# Altium project Board_Project.PrjPCB
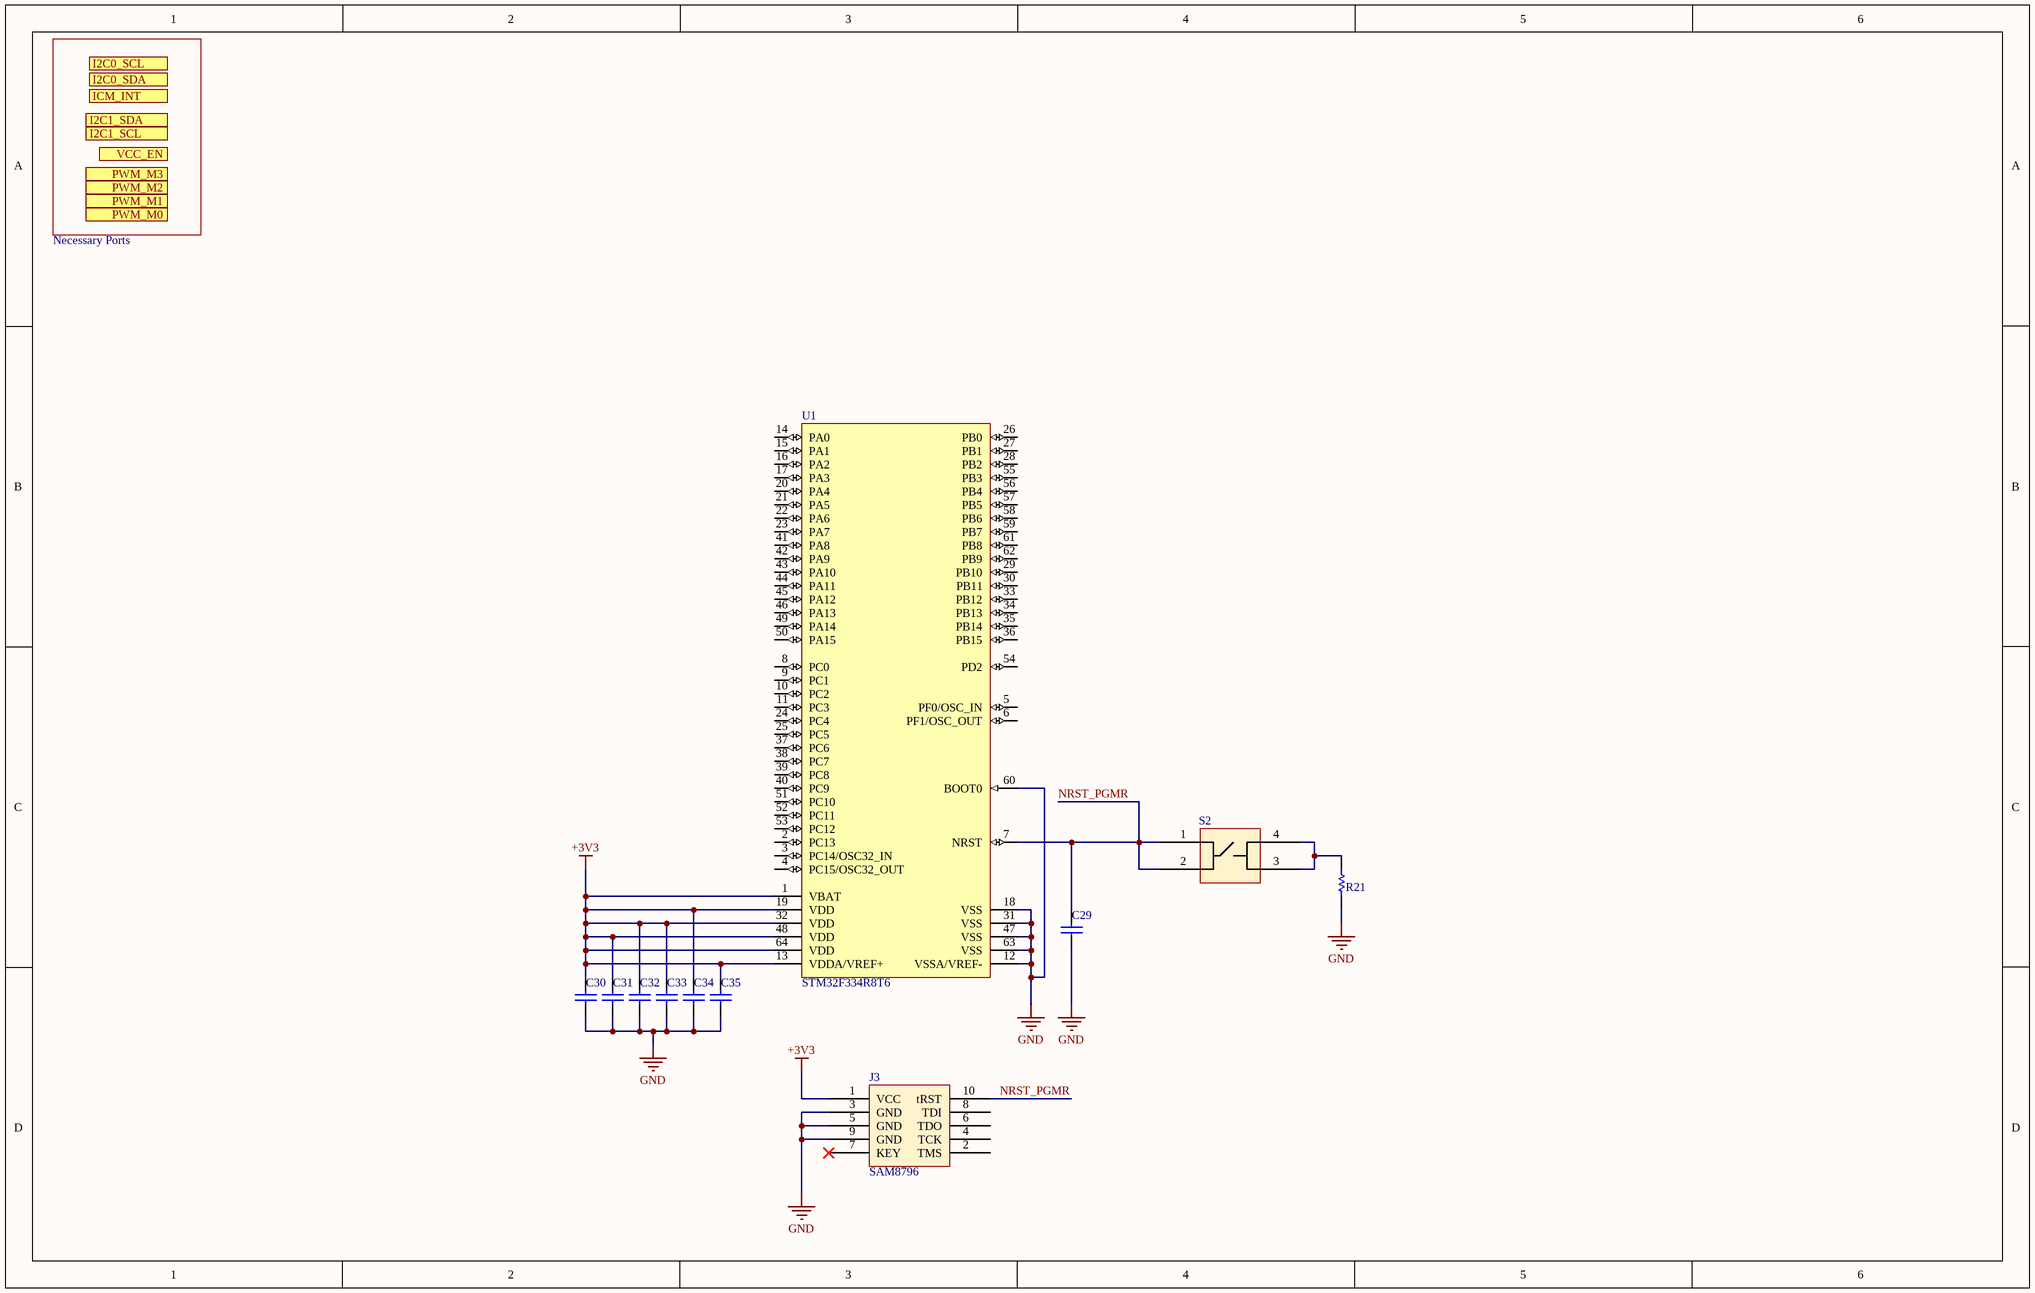
[diagram p0: FC_MC_SCH.SchDoc]
8 sheets, 111 parts. Net scope: flat (ports and power ports of the same name join across sheets).
Board file: Control_Brd.PcbDoc
Sheets:
  FC_MC_SCH.SchDoc
  WiFi_SCH.SchDoc
  IMU_SCH.SchDoc
  LED_SCH.SchDoc
  Signal_Pow_Reg_SCH.SchDoc
  Black_Magic_SCH.SchDoc
  AUX_CPU_SCH.SchDoc
  Bluetooth_SCH.SchDoc

## Sheet FC_MC_SCH.SchDoc
size 381 x 241 mm

### Parts
C29  CAP0402  [CAPC0402(1005)60_L]  (value not drawn)
C30  CAP0402  [CAPC0402(1005)60_L]  (value not drawn)
C31  CAP0402  [CAPC0402(1005)60_L]  (value not drawn)
C32  CAP0402  [CAPC0402(1005)60_L]  (value not drawn)
C33  CAP0402  [CAPC0402(1005)60_L]  (value not drawn)
C34  CAP0402  [CAPC0402(1005)60_L]  (value not drawn)
C35  CAP0402  [CAPC0402(1005)60_L]  (value not drawn)
J3  SAM8796
R21  RES-2  [RES 0402]  (value not drawn)
S2  PTS 647  (value not drawn)
U1  STM32F334R8T6  [STM-LQFP64_L]

### Ports
I2C0_SCL, I2C0_SDA, I2C1_SCL, I2C1_SDA, ICM_INT, PWM_M0 (in), PWM_M1 (in), PWM_M2 (in), PWM_M3 (in), VCC_EN (in)

### Nets
+3V3: C30.2 C31.2 C32.2 C33.2 C34.2 C35.2 J3.1(VCC) U1.1(VBAT) U1.13(VDDA/VREF+) U1.19(VDD) U1.32(VDD) U1.48(VDD) U1.64(VDD)
GND: C29.1 C30.1 C31.1 C32.1 C33.1 C34.1 C35.1 J3.3(GND) J3.5(GND) J3.9(GND) R21.2 U1.12(VSSA/VREF-) U1.18(VSS) U1.31(VSS) U1.47(VSS) U1.60(BOOT0) U1.63(VSS)
NRST_PGMR: C29.2 J3.10(tRST) S2.1 S2.2 U1.7(NRST)
NetR21_1: R21.1 S2.3 S2.4

Not connected (* = marked no-connect by the designer): J3 2(TMS) 4(TCK) 6(TDO) 7(KEY)* 8(TDI); U1 2(PC13) 3(PC14/OSC32_IN) 4(PC15/OSC32_OUT) 5(PF0/OSC_IN) 6(PF1/OSC_OUT) 8(PC0) 9(PC1) 10(PC2) 11(PC3) 14(PA0) 15(PA1) 16(PA2) 17(PA3) 20(PA4) 21(PA5) 22(PA6) 23(PA7) 24(PC4) 25(PC5) 26(PB0) 27(PB1) 28(PB2) 29(PB10) 30(PB11) 33(PB12) 34(PB13) 35(PB14) 36(PB15) 37(PC6) 38(PC7) 39(PC8) 40(PC9) 41(PA8) 42(PA9) 43(PA10) 44(PA11) 45(PA12) 46(PA13) 49(PA14) 50(PA15) 51(PC10) 52(PC11) 53(PC12) 54(PD2) 55(PB3) 56(PB4) 57(PB5) 58(PB6) 59(PB7) 61(PB8) 62(PB9)

### Notes on the sheet
- Necessary Ports

### Library data of the parts
C29 C31 C33-C35 = CMP-1590-00004-1: 0402 (1005 Metric) Chip Capacitor; Case-EIA: 0402; Value: 100n; Case-Metric: 1005; PackageReference: CAPC0402(1005)60
C30 = CMP-1590-00004-1: 0402 (1005 Metric) Chip Capacitor; Case-EIA: 0402; Value: 1u; Case-Metric: 1005; PackageReference: CAPC0402(1005)60
C32 = CMP-1590-00004-1: 0402 (1005 Metric) Chip Capacitor; Case-EIA: 0402; Value: 4.7u; Case-Metric: 1005; PackageReference: CAPC0402(1005)60
R21 = RES: Value: 5k
S2 = TactileSW
U1 = CMP-0537-00077-1: ARM Cortex-M4 32-bit MCU, 64 KB Flash, 16 KB Internal RAM, 51 I/Os, 64-Pin LQFP, -40 to 85 degC, Tray; Supply Voltage(Vcc) min (V): 2; D/A Converter: 3; Internal RAM Size (kB): 16; FLASH Size (Prog) (kB): 64; Operating Frequency(F) (Processor speed) (MHz): 72; I/Os (High Current): 51; ComponentLink1Description: Manufacturer URL; ComponentLink2URL: http://www.st.com/st-web-ui/static/active/en/resource/technical/document/datasheet/DM00097745.pdf; Package Reference: LQFP64; ComponentLink1URL: http://www.st.com/; ComponentLink2Description: Datasheet; DatasheetVersion: Rev. 4; Mounting Technology: Surface Mount; Package Description: 64-Pin Low-profile Quad Flat Package, Body 10 x 10 mm, Pitch 0.5 mm; Packing: Tray; Core: ARM Cortex-M4

## Sheet WiFi_SCH.SchDoc
size A
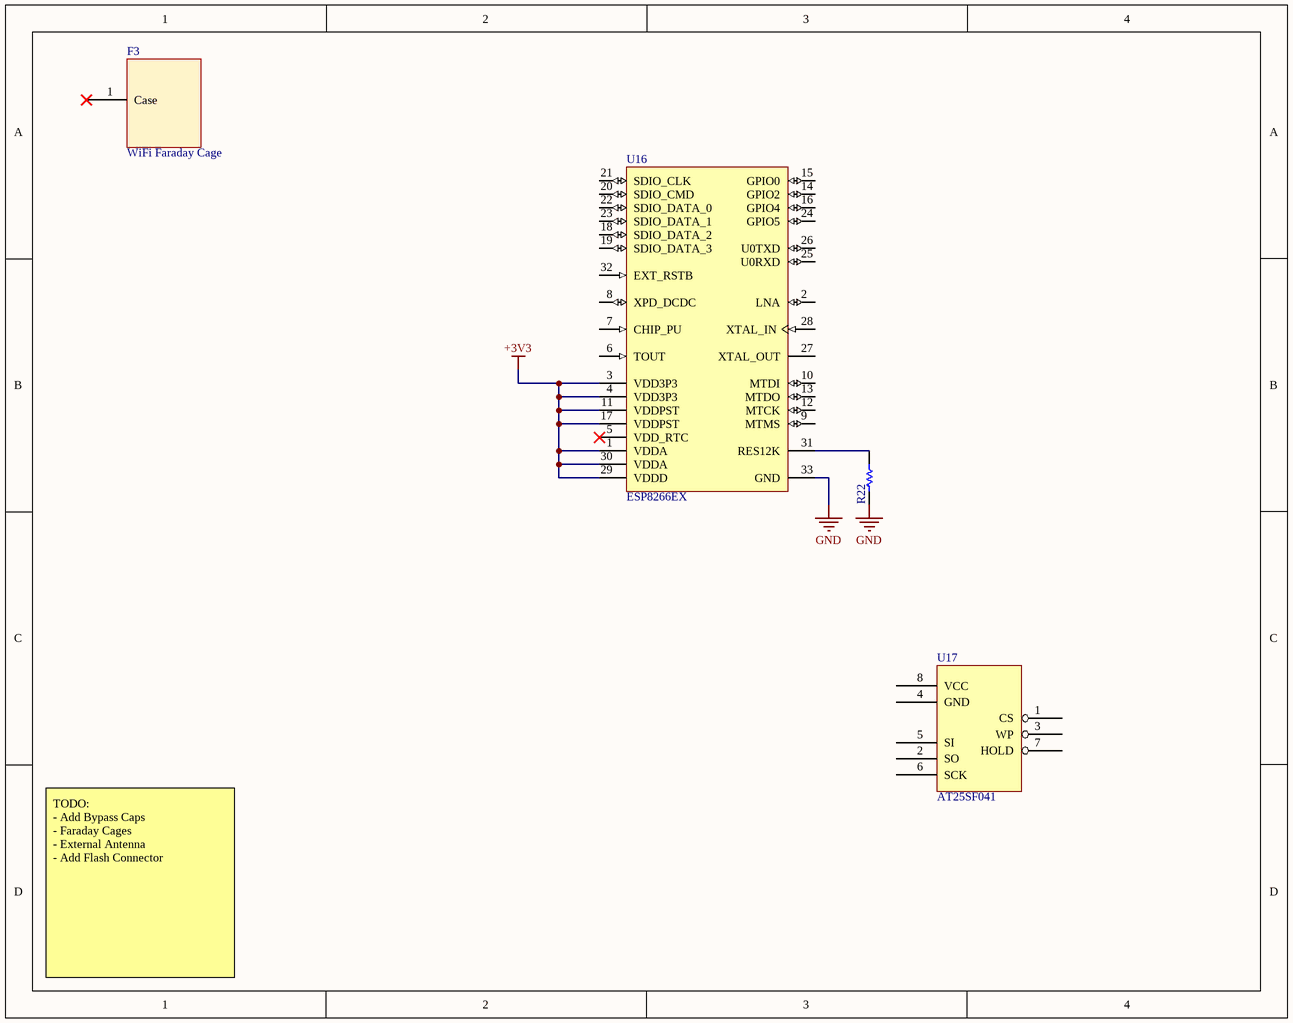
[diagram p1: WiFi_SCH.SchDoc]

### Parts
F3  WiFi Faraday Cage
R22  RES-2  [RES 0402]  (value not drawn)
U16  ESP8266EX  [ESFS-QFN-32_L]
U17  AT25SF041  [SOIC127P600X175-8N]

### Nets
+3V3: U16.1(VDDA) U16.3(VDD3P3) U16.4(VDD3P3) U16.11(VDDPST) U16.17(VDDPST) U16.29(VDDD) U16.30(VDDA)
GND: R22.1 U16.33(GND)
NetR22_2: R22.2 U16.31(RES12K)

Not connected (* = marked no-connect by the designer): F3 1(Case)*; U16 2(LNA) 5(VDD_RTC)* 6(TOUT) 7(CHIP_PU) 8(XPD_DCDC) 9(MTMS) 10(MTDI) 12(MTCK) 13(MTDO) 14(GPIO2) 15(GPIO0) 16(GPIO4) 18(SDIO_DATA_2) 19(SDIO_DATA_3) 20(SDIO_CMD) 21(SDIO_CLK) 22(SDIO_DATA_0) 23(SDIO_DATA_1) 24(GPIO5) 25(U0RXD) 26(U0TXD) 27(XTAL_OUT) 28(XTAL_IN) 32(EXT_RSTB); U17 1(CS) 2(SO) 3(WP) 4(GND) 5(SI) 6(SCK) 7(HOLD) 8(VCC)

### Notes on the sheet
- TODO:
  - Add Bypass Caps
  - Faraday Cages
  - External Antenna
  - Add Flash Connector

### Library data of the parts
F3 = FARADAY_CAGE
R22 = RES: Value: 12k; Tolerance: 1%
U16 = CMP-2000-07453-1: Low-Power, Highly-Integrated Wi-Fi Solution, 2.5 to 3.6 V, 80 mA, -40 to 125 degC, 32-Pin QFN; Manufacturer: Espressif Systems; Mounting Technology: SurfaceMount; Datasheet URL: http://espressif.com/sites/default/files/documentation/0a-esp8266ex_datasheet_en.pdf; Package Reference: QFN-32; Package Description: 32-Pin Quad Falt No-Lead, Body 5 x 5 mm, Pitch 0.5 mm; Manufacturer URL: http://espressif.com; Datasheet Version: Rev. 5.4, 04/2017
U17 = AT25SF041: IC FLASH 4M SPI 104MHZ 8SOIC; ComponentLink1Description: DigiKey; ComponentLink1URL: https://www.digikey.com/product-detail/en/adesto-technologies/AT25SF041-SSHD-T/1265-1131-1-ND/

## Sheet IMU_SCH.SchDoc
size A
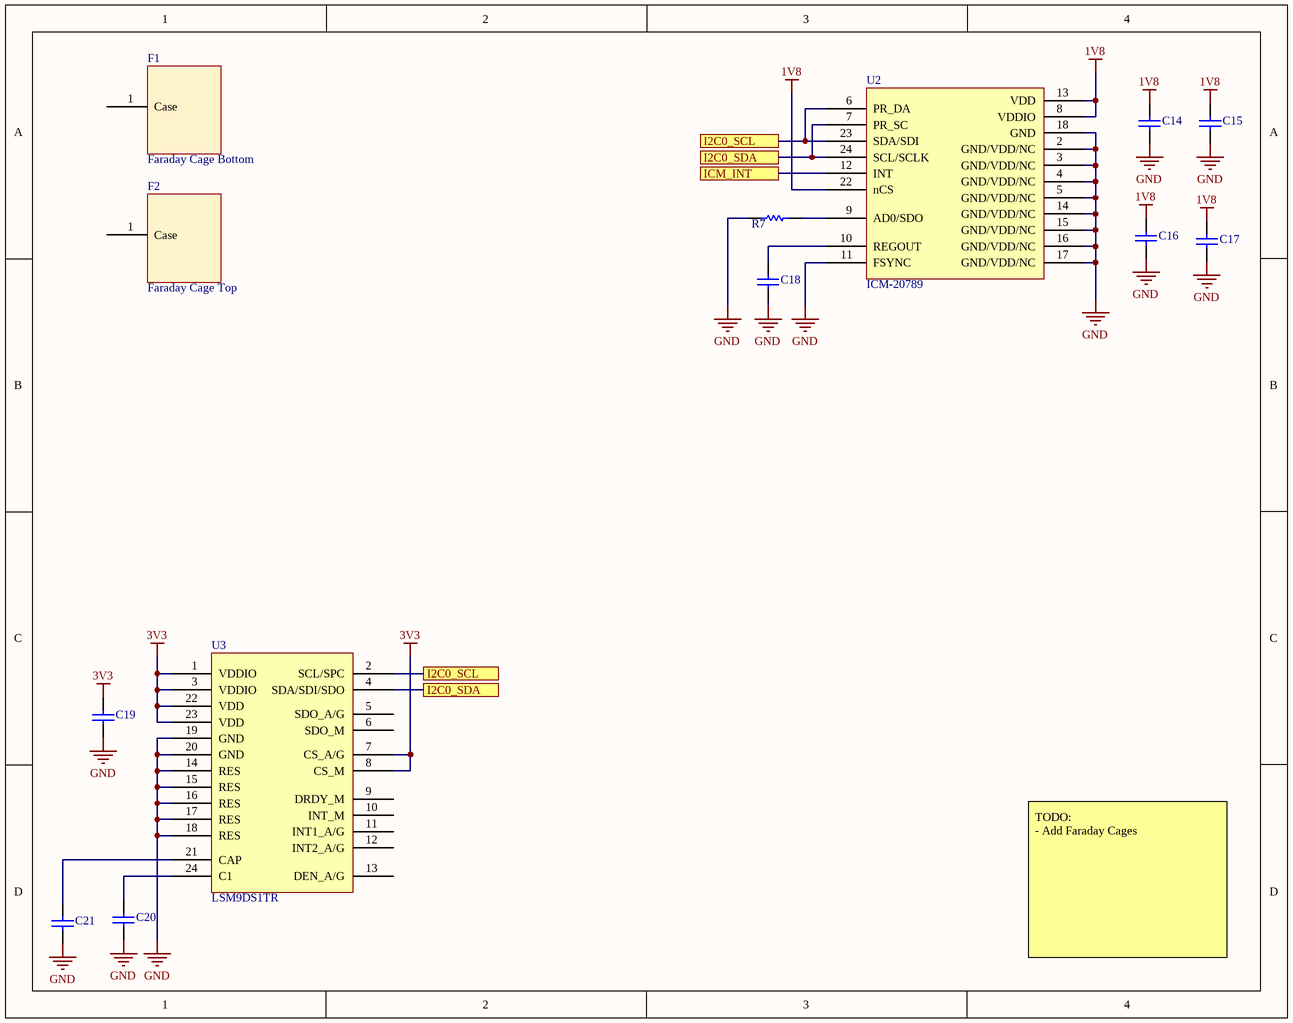
[diagram p2: IMU_SCH.SchDoc]

### Parts
C14  08055C104KAJ2A  [CAPC2013X140X50NL20T25]  (value not drawn)
C15  08055C104KAJ2A  [CAPC2013X140X50NL20T25]  (value not drawn)
C16  08055C104KAJ2A  [CAPC2013X140X50NL20T25]  (value not drawn)
C17  08055C104KAJ2A  [CAPC2013X140X50NL20T25]  (value not drawn)
C18  08055C104KAJ2A  [CAPC2013X140X50NL20T25]  (value not drawn)
C19  08055C104KAJ2A  [CAPC2013X140X50NL20T25]  (value not drawn)
C20  08055C104KAJ2A  [CAPC2013X140X50NL20T25]  (value not drawn)
C21  08055C104KAJ2A  [CAPC2013X140X50NL20T25]  (value not drawn)
F1  Faraday Cage Bottom
F2  Faraday Cage Top
R7  ERJ-6ENF1503V  [RESC2013X70X40LL20T20]  (value not drawn)
U2  ICM-20789  [24LGA]
U3  LSM9DS1TR  [24LGA_Elongated]

### Ports
I2C0_SCL, I2C0_SDA, ICM_INT

### Nets
1V8: C14.2 C15.2 C16.2 C17.2 U2.8(VDDIO) U2.13(VDD) U2.22(nCS)
3V3: C19.2 U3.1(VDDIO) U3.3(VDDIO) U3.7(CS_A/G) U3.8(CS_M) U3.22(VDD) U3.23(VDD)
GND: C14.1 C15.1 C16.1 C17.1 C18.1 C19.1 C20.1 C21.1 R7.1 U2.2(GND/VDD/NC) U2.3(GND/VDD/NC) U2.4(GND/VDD/NC) U2.5(GND/VDD/NC) U2.11(FSYNC) U2.14(GND/VDD/NC) U2.15(GND/VDD/NC) U2.16(GND/VDD/NC) U2.17(GND/VDD/NC) U2.18(GND) U3.14(RES) U3.15(RES) U3.16(RES) U3.17(RES) U3.18(RES) U3.19(GND) U3.20(GND)
NetC18_2: C18.2 U2.10(REGOUT)
NetC20_2: C20.2 U3.24(C1)
NetC21_2: C21.2 U3.21(CAP)
NetR7_2: R7.2 U2.9(AD0/SDO)
NetU2_6: U2.6(PR_DA) U2.23(SDA/SDI) U3.2(SCL/SPC) ; port I2C0_SCL
NetU2_7: U2.7(PR_SC) U2.24(SCL/SCLK) U3.4(SDA/SDI/SDO) ; port I2C0_SDA
NetU2_12: U2.12(INT) ; port ICM_INT

Not connected (* = marked no-connect by the designer): F1 1(Case); F2 1(Case); U3 5(SDO_A/G) 6(SDO_M) 9(DRDY_M) 10(INT_M) 11(INT1_A/G) 12(INT2_A/G) 13(DEN_A/G)

### Notes on the sheet
- TODO:
  - Add Faraday Cages

### Library data of the parts
C14-C21 = CMP-2007-04765-1: Manufacturer: AVX Interconnect / Elco; Part Number: 08055C104KAJ2A
F1 F2 = FARADAY_CAGE
R7 = CMP-2001-04440-2: RES SMD 150K OHM 1% 1/8W 0805; Manufacturer: Panasonic; Datasheet: http://industrial.panasonic.com/cdbs/www-data/pdf/RDA0000/AOA0000C86.pdf; Part Number: ERJ-6ENF1503V
U2 = ICM-20789: MOTION SENSOR IC; ComponentLink1Description: DigiKey; ComponentLink1URL: https://www.digikey.com/product-detail/en/tdk-invensense/ICM-20789/1428-1133-6-ND/
U3 = LSM9DS1TR: IMU ACCEL/GYRO/MAG I2C/SPI 24LGA; ComponentLink1Description: DigiKey; ComponentLink1URL: https://www.digikey.com/product-detail/en/stmicroelectronics/LSM9DS1TR/497-14946-1-ND/

## Sheet LED_SCH.SchDoc
size A
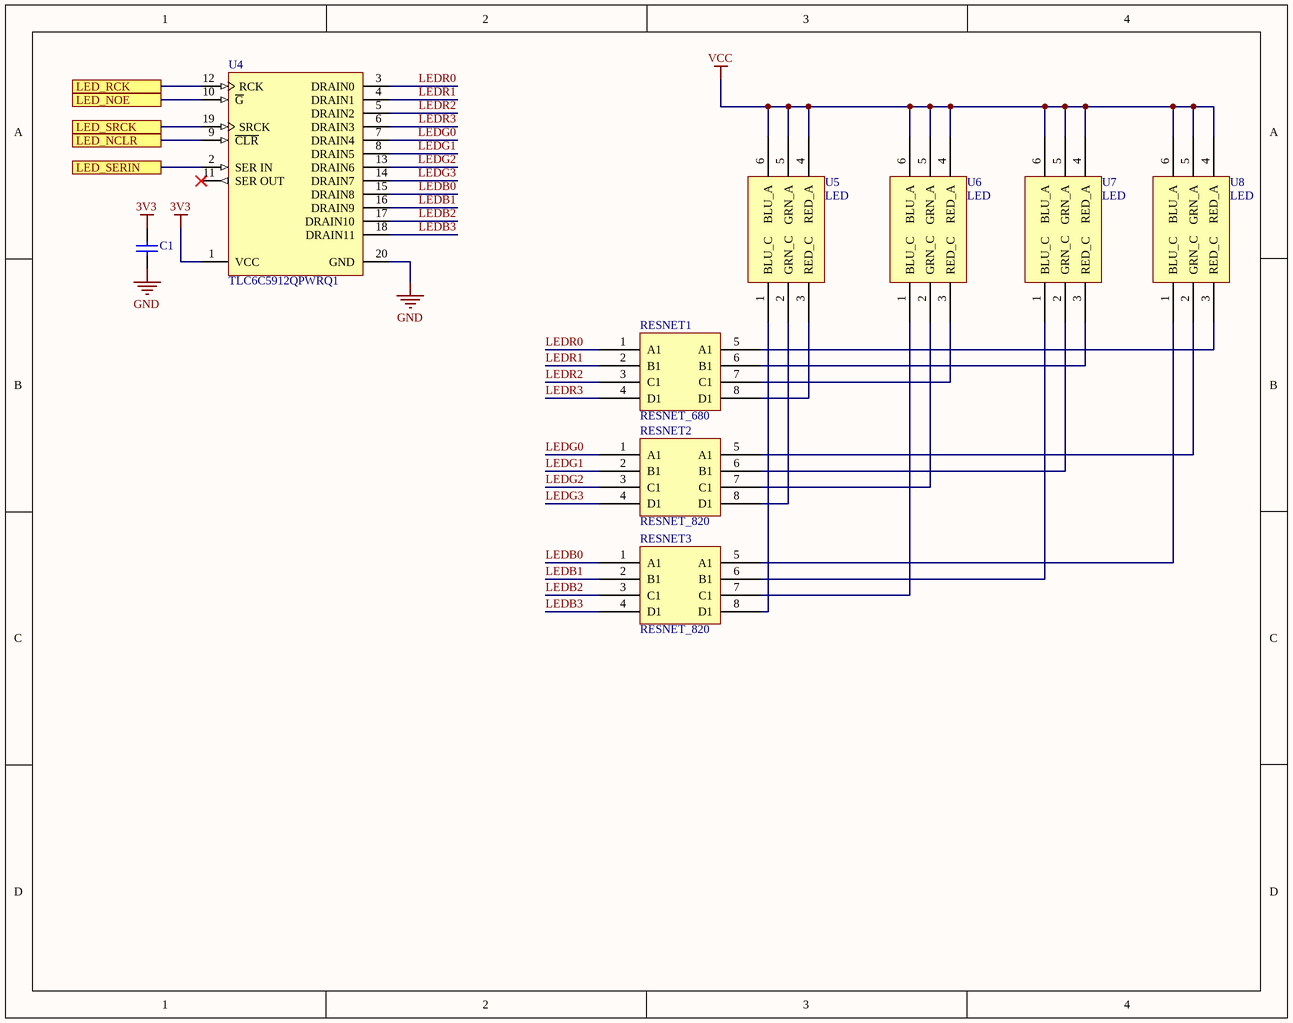
[diagram p3: LED_SCH.SchDoc]

### Parts
C1  08055C104KAJ2A  [CAPC2013X140X50NL20T25]  (value not drawn)
RESNET1  RESNET_680  [CAC-80P320X165-8N]
RESNET2  RESNET_820  [74X_RESNET]
RESNET3  RESNET_820  [74X_RESNET]
U4  TLC6C5912QPWRQ1  [PW0020A_N]
U5  LED  [PLCC6]
U6  LED  [PLCC6]
U7  LED  [PLCC6]
U8  LED  [PLCC6]

### Ports
LED_NCLR, LED_NOE, LED_RCK, LED_SERIN, LED_SRCK

### Nets
3V3: C1.2 U4.1(VCC)
GND: C1.1 U4.20(GND)
VCC: U5.4(RED_A) U5.5(GRN_A) U5.6(BLU_A) U6.4(RED_A) U6.5(GRN_A) U6.6(BLU_A) U7.4(RED_A) U7.5(GRN_A) U7.6(BLU_A) U8.4(RED_A) U8.5(GRN_A) U8.6(BLU_A)
LEDB0: RESNET3.1(A1) U4.15(DRAIN8)
LEDB1: RESNET3.2(B1) U4.16(DRAIN9)
LEDB2: RESNET3.3(C1) U4.17(DRAIN10)
LEDB3: RESNET3.4(D1) U4.18(DRAIN11)
LEDG0: RESNET2.1(A1) U4.7(DRAIN4)
LEDG1: RESNET2.2(B1) U4.8(DRAIN5)
LEDG2: RESNET2.3(C1) U4.13(DRAIN6)
LEDG3: RESNET2.4(D1) U4.14(DRAIN7)
LEDR0: RESNET1.1(A1) U4.3(DRAIN0)
LEDR1: RESNET1.2(B1) U4.4(DRAIN1)
LEDR2: RESNET1.3(C1) U4.5(DRAIN2)
LEDR3: RESNET1.4(D1) U4.6(DRAIN3)
NetRESNET1_5: RESNET1.5(A1) U8.3(RED_C)
NetRESNET1_6: RESNET1.6(B1) U7.3(RED_C)
NetRESNET1_7: RESNET1.7(C1) U6.3(RED_C)
NetRESNET1_8: RESNET1.8(D1) U5.3(RED_C)
NetRESNET2_5: RESNET2.5(A1) U8.2(GRN_C)
NetRESNET2_6: RESNET2.6(B1) U7.2(GRN_C)
NetRESNET2_7: RESNET2.7(C1) U6.2(GRN_C)
NetRESNET2_8: RESNET2.8(D1) U5.2(GRN_C)
NetRESNET3_5: RESNET3.5(A1) U8.1(BLU_C)
NetRESNET3_6: RESNET3.6(B1) U7.1(BLU_C)
NetRESNET3_7: RESNET3.7(C1) U6.1(BLU_C)
NetRESNET3_8: RESNET3.8(D1) U5.1(BLU_C)
NetU4_2: U4.2(SER_IN) ; port LED_SERIN
NetU4_9: U4.9(~{CLR}) ; port LED_NCLR
NetU4_10: U4.10(~{G}) ; port LED_NOE
NetU4_12: U4.12(RCK) ; port LED_RCK
NetU4_19: U4.19(SRCK) ; port LED_SRCK

Not connected (* = marked no-connect by the designer): U4 11(SER_OUT)*

### Library data of the parts
C1 = CMP-2007-04765-1: Manufacturer: AVX Interconnect / Elco; Part Number: 08055C104KAJ2A
RESNET1 = RESNET_680: RES ARRAY 4 RES 680 OHM 2012; ComponentLink1Description: DigiKey; ComponentLink1URL: https://www.digikey.com/product-detail/en/cts-resistor-products/744C083681JP/744C083681JPCT-ND/
RESNET2 RESNET3 = RESNET_820: RES ARRAY 4 RES 820 OHM 2012; ComponentLink1Description: DigiKey; ComponentLink1URL: https://www.digikey.com/product-detail/en/cts-resistor-products/744C083681JP/744C083681JPCT-ND/
U4 = CMP-1582-00026-1: Automotive Power Logic 12-Bit Shift Register LED Driver, PW0020A, LARGE T&R; Part Number: TLC6C5912-Q1; rDS(on)(Ohms): 7.4; tPLH(ns): 210; IO(CONT)(A): 0.05; ICC(uA): 130; VDS(Max)(V): 40; ComponentLink2URL: http://www.ti.com/lit/ds/symlink/tlc6c5912-q1.pdf; ComponentLink1Description: Manufacturer URL; ComponentLink1URL: http://www.ti.com/; Rating: Automotive; Operating Temperature Range(C): -40 to 125; ComponentLink2Description: Datasheet; PackageReference: PW0020A; PartNumber: TLC6C5912QPWRQ1; DatasheetVersion: SLIS141A

## Sheet Signal_Pow_Reg_SCH.SchDoc
size A
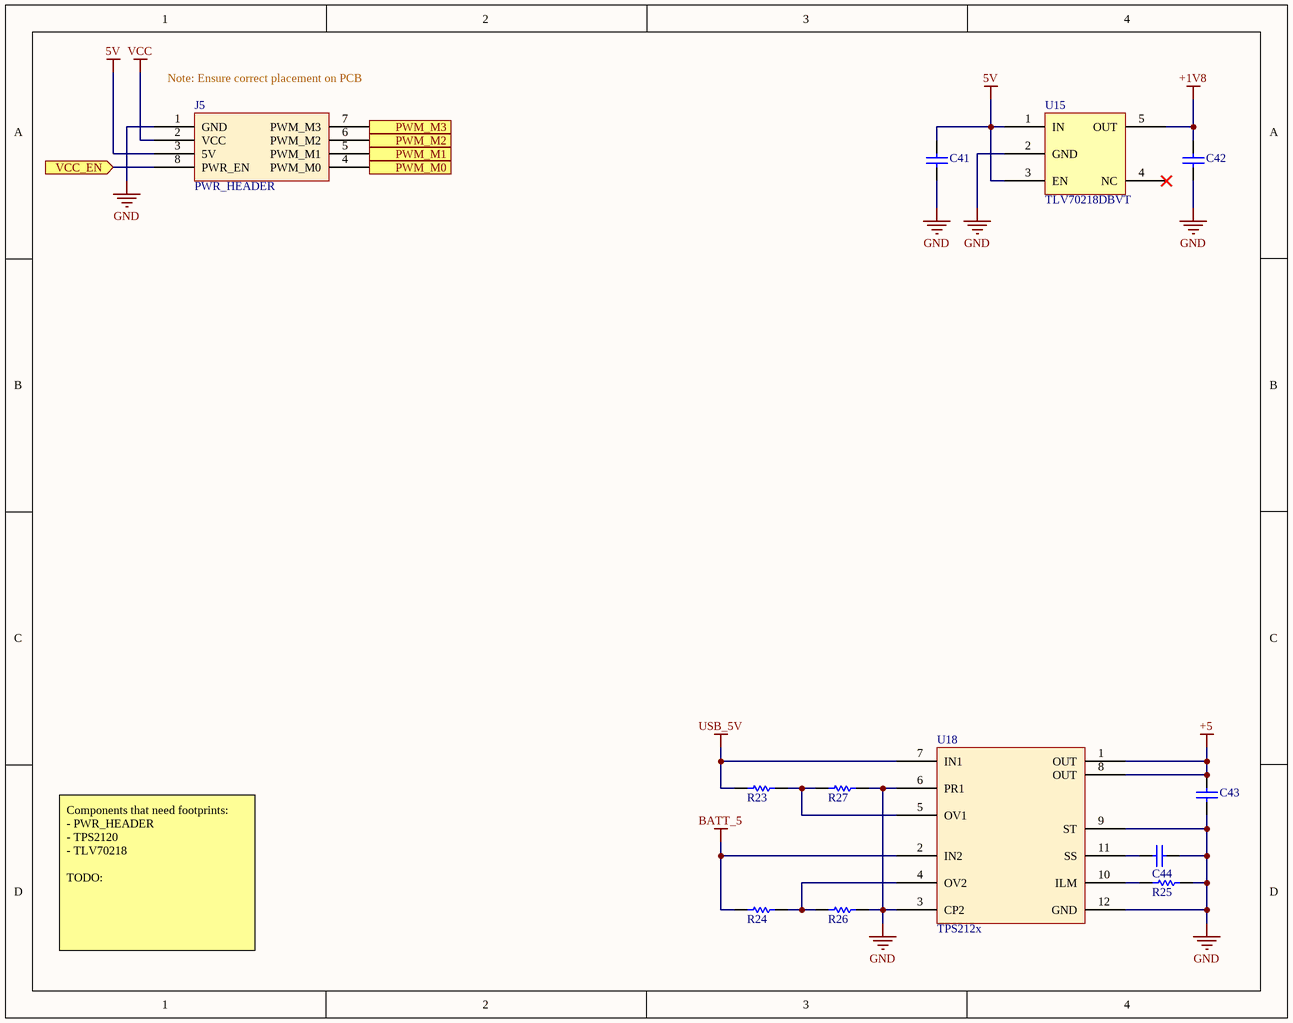
[diagram p4: Signal_Pow_Reg_SCH.SchDoc]

### Parts
C41  08055C104KAJ2A  [CAPC2013X140X50NL20T25]  (value not drawn)
C42  08055C104KAJ2A  [CAPC2013X140X50NL20T25]  (value not drawn)
C43  08055C104KAJ2A  [CAPC2013X140X50NL20T25]  (value not drawn)
C44  08055C104KAJ2A  [CAPC2013X140X50NL20T25]  (value not drawn)
J5  PWR_HEADER
R23  ERJ-6ENF1503V  [RESC2013X70X40LL20T20]  (value not drawn)
R24  ERJ-6ENF1503V  [RESC2013X70X40LL20T20]  (value not drawn)
R25  ERJ-6ENF1503V  [RESC2013X70X40LL20T20]  (value not drawn)
R26  ERJ-6ENF1503V  [RESC2013X70X40LL20T20]  (value not drawn)
R27  ERJ-6ENF1503V  [RESC2013X70X40LL20T20]  (value not drawn)
U15  TLV70218DBVT
U18  TPS212x

### Ports
PWM_M0 (in), PWM_M1 (in), PWM_M2 (in), PWM_M3 (in), VCC_EN (in)

### Nets
5V: C41.2 J5.3(5V) U15.1(IN) U15.3(EN)
+1V8: C42.2 U15.5(OUT)
+5: C43.2 U18.1(OUT) U18.8(OUT)
BATT_5: R24.2 U18.2(IN2)
GND: C41.1 C42.1 C43.1 C44.2 J5.1(GND) R25.2 R26.2 R27.2 U15.2(GND) U18.3(CP2) U18.6(PR1) U18.9(ST) U18.12(GND)
USB_5V: R23.2 U18.7(IN1)
VCC: J5.2(VCC)
NetC44_1: C44.1 U18.11(SS)
NetJ5_4: J5.4(PWM_M0) ; port PWM_M0
NetJ5_5: J5.5(PWM_M1) ; port PWM_M1
NetJ5_6: J5.6(PWM_M2) ; port PWM_M2
NetJ5_7: J5.7(PWM_M3) ; port PWM_M3
NetJ5_8: J5.8(PWR_EN) ; port VCC_EN
NetR23_1: R23.1 R27.1 U18.5(OV1)
NetR24_1: R24.1 R26.1 U18.4(OV2)
NetR25_1: R25.1 U18.10(ILM)

Not connected (* = marked no-connect by the designer): U15 4(NC)*

### Notes on the sheet
- (near J5) Note: Ensure correct placement on PCB
- Components that need footprints:
  - PWR_HEADER
  - TPS2120
  - TLV70218
  TODO:

### Library data of the parts
C41 C42 = CMP-2007-04765-1: Manufacturer: AVX Interconnect / Elco; Value: 1u; Part Number: 08055C104KAJ2A
C43 = CMP-2007-04765-1: Manufacturer: AVX Interconnect / Elco; Value: 100u; Part Number: 08055C104KAJ2A
C44 = CMP-2007-04765-1: Manufacturer: AVX Interconnect / Elco; Value: 0.01u; Part Number: 08055C104KAJ2A
R23 R24 = CMP-2001-04440-2: RES SMD 150K OHM 1% 1/8W 0805; Manufacturer: Panasonic; Value: 23.7k; Datasheet: http://industrial.panasonic.com/cdbs/www-data/pdf/RDA0000/AOA0000C86.pdf; Part Number: ERJ-6ENF1503V
R25 = CMP-2001-04440-2: RES SMD 150K OHM 1% 1/8W 0805; Manufacturer: Panasonic; Value: 51.1k; Datasheet: http://industrial.panasonic.com/cdbs/www-data/pdf/RDA0000/AOA0000C86.pdf; Part Number: ERJ-6ENF1503V
R26 R27 = CMP-2001-04440-2: RES SMD 150K OHM 1% 1/8W 0805; Manufacturer: Panasonic; Value: 5k; Datasheet: http://industrial.panasonic.com/cdbs/www-data/pdf/RDA0000/AOA0000C86.pdf; Part Number: ERJ-6ENF1503V
U15 = TLV702
U18 = TPS212x: PWR MGMT BATTERY MGMT

## Sheet Black_Magic_SCH.SchDoc
size 381 x 241 mm
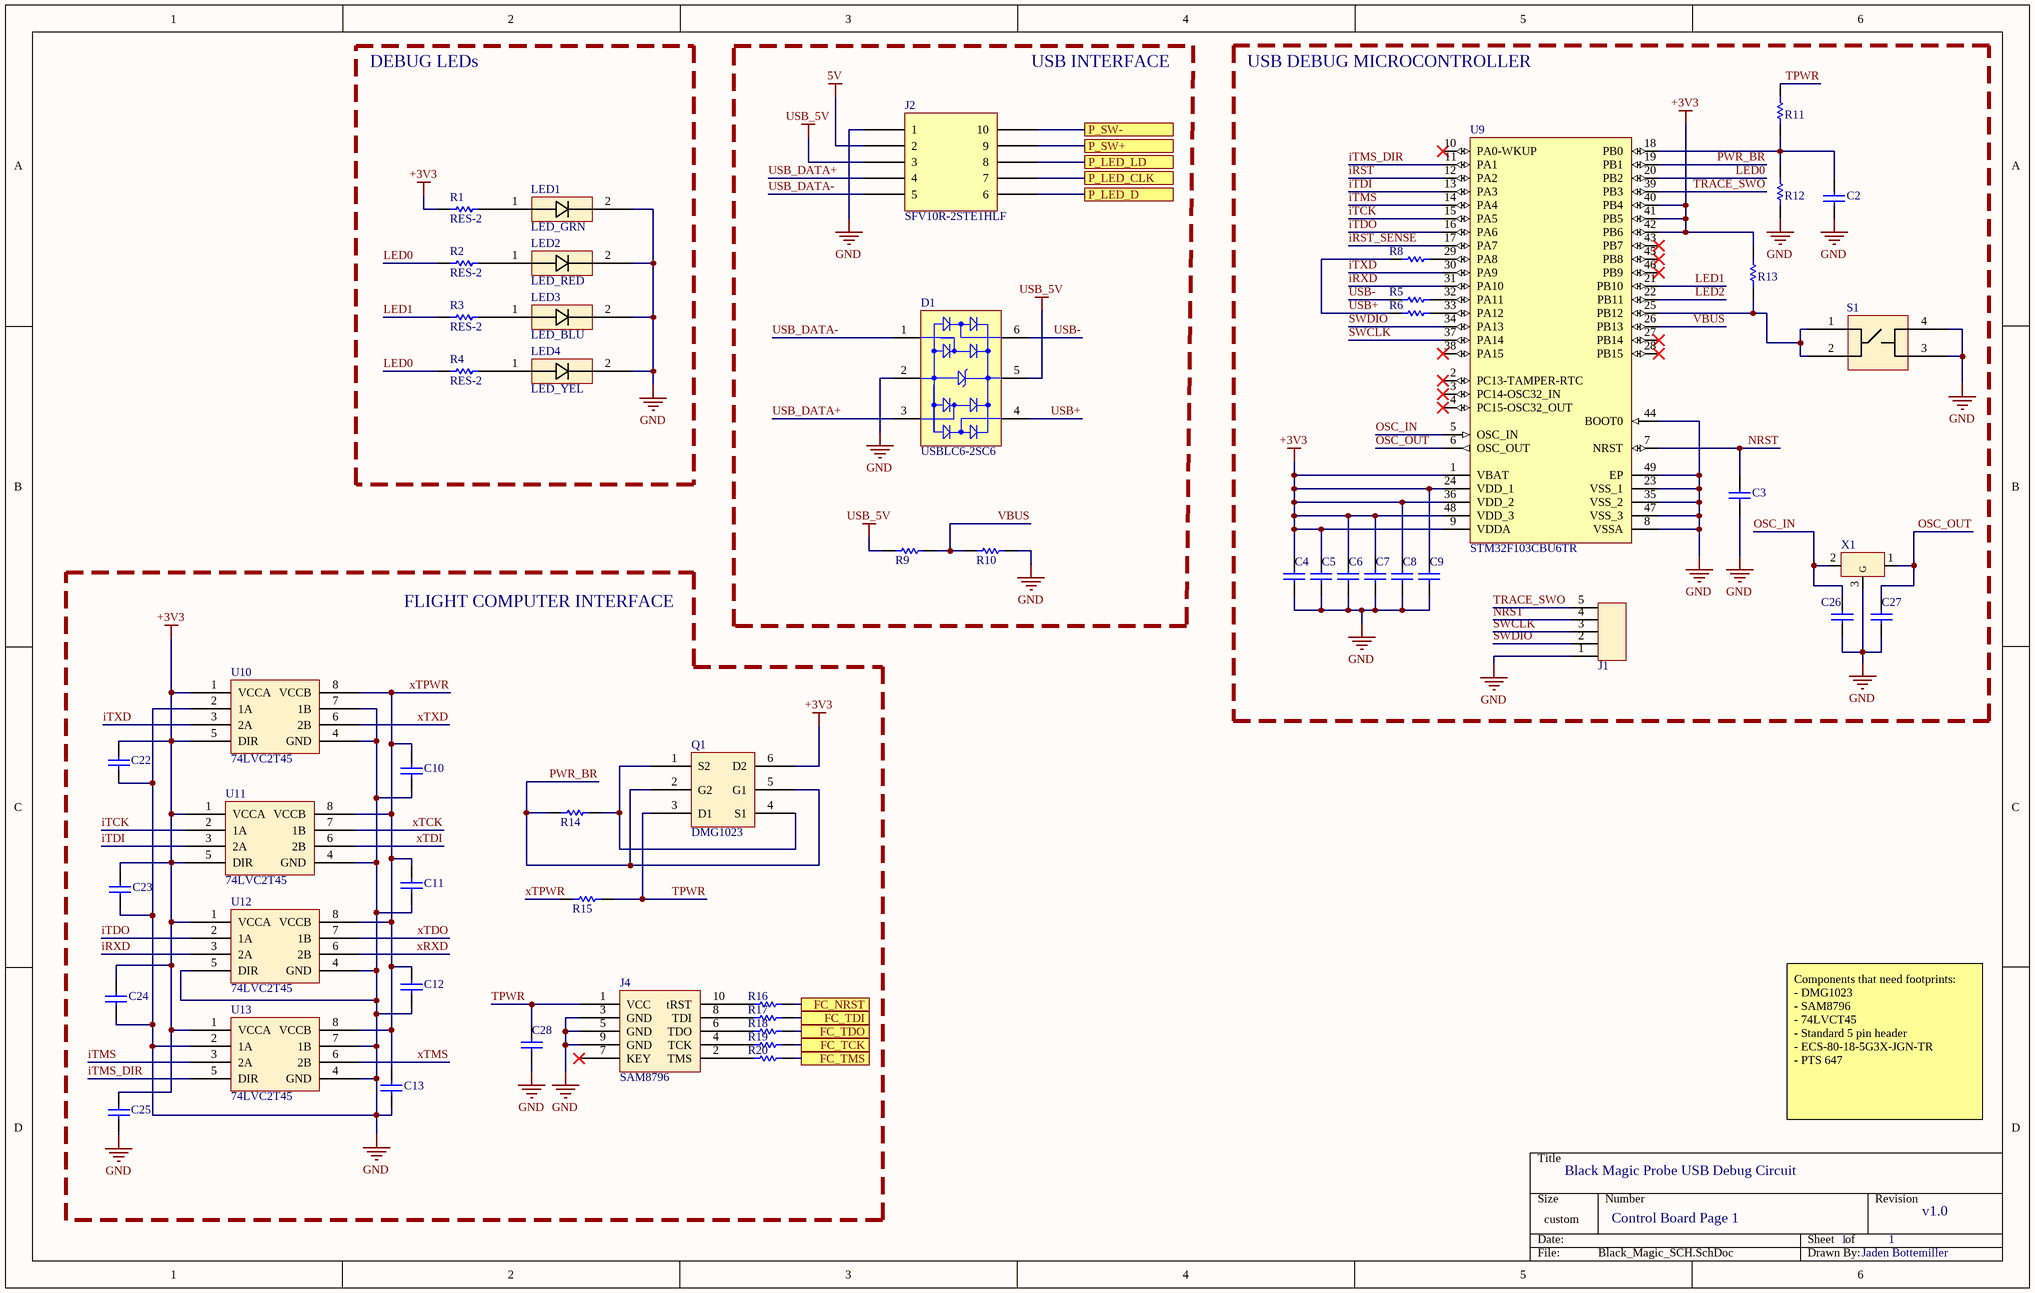
[diagram p5: Black_Magic_SCH.SchDoc]

### Parts
C2  CAP0402  [CAPC0402(1005)60_L]  (value not drawn)
C3  CAP0402  [CAPC0402(1005)60_L]  (value not drawn)
C4  CAP0402  [CAPC0402(1005)60_L]  (value not drawn)
C5  CAP0402  [CAPC0402(1005)60_L]  (value not drawn)
C6  CAP0402  [CAPC0402(1005)60_L]  (value not drawn)
C7  CAP0402  [CAPC0402(1005)60_L]  (value not drawn)
C8  CAP0402  [CAPC0402(1005)60_L]  (value not drawn)
C9  CAP0402  [CAPC0402(1005)60_L]  (value not drawn)
C10  CAP0402  [CAPC0402(1005)60_L]  (value not drawn)
C11  CAP0402  [CAPC0402(1005)60_L]  (value not drawn)
C12  CAP0402  [CAPC0402(1005)60_L]  (value not drawn)
C13  CAP0402  [CAPC0402(1005)60_L]  (value not drawn)
C22  CAP0402  [CAPC0402(1005)60_L]  (value not drawn)
C23  CAP0402  [CAPC0402(1005)60_L]  (value not drawn)
C24  CAP0402  [CAPC0402(1005)60_L]  (value not drawn)
C25  CAP0402  [CAPC0402(1005)60_L]  (value not drawn)
C26  CAP0402  [CAPC0402(1005)60_L]  (value not drawn)
C27  CAP0402  [CAPC0402(1005)60_L]  (value not drawn)
C28  CAP0402  [CAPC0402(1005)60_L]  (value not drawn)
D1  USBLC6-2SC6  [STM-SOT23-6L_V]
J1  5PIN_Standard  (value not drawn)
J2  SFV10R-2STE1HLF
J4  SAM8796
LED1  LED_GRN  [DIOC3212X08N]
LED2  LED_RED  [DIOC3212X08N]
LED3  LED_BLU  [DIOC3212X08N]
LED4  LED_YEL  [DIOC3212X08N]
Q1  DMG1023
R1  RES-2  [RES 0402]
R2  RES-2  [RES 0402]
R3  RES-2  [RES 0402]
R4  RES-2  [RES 0402]
R5  RES-2  [RES 0402]  (value not drawn)
R6  RES-2  [RES 0402]  (value not drawn)
R8  RES-2  [RES 0402]  (value not drawn)
R9  RES-2  [RES 0402]  (value not drawn)
R10  RES-2  [RES 0402]  (value not drawn)
R11  RES-2  [RES 0402]  (value not drawn)
R12  RES-2  [RES 0402]  (value not drawn)
R13  RES-2  [RES 0402]  (value not drawn)
R14  RES-2  [RES 0402]  (value not drawn)
R15  RES-2  [RES 0402]  (value not drawn)
R16  RES-2  [RES 0402]  (value not drawn)
R17  RES-2  [RES 0402]  (value not drawn)
R18  RES-2  [RES 0402]  (value not drawn)
R19  RES-2  [RES 0402]  (value not drawn)
R20  RES-2  [RES 0402]  (value not drawn)
S1  PTS 647  (value not drawn)
U9  STM32F103CBU6TR  [STM-UFQFPN48_L]
U10  74LVC2T45
U11  74LVC2T45
U12  74LVC2T45
U13  74LVC2T45
X1  ECS-80-18-5G3X-JGN-TR  (value not drawn)

### Blocks framed on the sheet
DEBUG LEDs: LED1-LED4 R1-R4
USB INTERFACE: D1 J2 R9 R10
USB DEBUG MICROCONTROLLER: C2-C9 C26 C27 J1 R5 R6 R8 R11-R13 S1 U9 X1
FLIGHT COMPUTER INTERFACE: C10-C13 C22-C25 C28 J4 Q1 R14-R20 U10-U13

### Ports
FC_NRST, FC_TCK, FC_TDI, FC_TDO, FC_TMS, P_LED_CLK, P_LED_D, P_LED_LD, P_SW+, P_SW-

### Nets
5V: J2.2
+3V3: C4.2 C5.2 C6.2 C7.2 C8.2 C9.2 C22.2 C23.2 C24.2 C25.2 Q1.6(D2) R1.1 R13.1 U9.1(VBAT) U9.9(VDDA) U9.24(VDD_1) U9.36(VDD_2) U9.40(PB4) U9.41(PB5) U9.42(PB6) U9.48(VDD_3) U10.1(VCCA) U10.5(DIR) U11.1(VCCA) U11.5(DIR) U12.1(VCCA) U13.1(VCCA)
GND: C2.1 C3.1 C4.1 C5.1 C6.1 C7.1 C8.1 C9.1 C10.1 C11.1 C12.1 C13.1 C22.1 C23.1 C24.1 C25.1 C26.1 C27.1 C28.1 D1.2(GND) J1.1(A) J2.1 J4.3(GND) J4.5(GND) J4.9(GND) LED1.2(Cathode) LED2.2(Cathode) LED3.2(Cathode) LED4.2(Cathode) R10.2 R12.2 S1.3 S1.4 U9.8(VSSA) U9.23(VSS_1) U9.35(VSS_2) U9.44(BOOT0) U9.47(VSS_3) U9.49(EP) U10.2(1A) U10.4(GND) U10.7(1B) U11.4(GND) U12.4(GND) U12.5(DIR) U13.2(1A) U13.4(GND) U13.7(1B) X1.3(G)
USB_5V: D1.5(VBUS) J2.3 R9.2
iRST: U9.12(PA2)
iRST_SENSE: U9.17(PA7)
iRXD: U9.31(PA10) U12.3(2A)
iTCK: U9.15(PA5) U11.2(1A)
iTDI: U9.13(PA3) U11.3(2A)
iTDO: U9.16(PA6) U12.2(1A)
iTMS: U9.14(PA4) U13.3(2A)
iTMS_DIR: U9.11(PA1) U13.5(DIR)
iTXD: U9.30(PA9) U10.3(2A)
LED0: R2.1 R4.1 U9.20(PB2)
LED1: R3.1 U9.21(PB10)
LED2: U9.22(PB11)
NRST: C3.2 J1.4(A) U9.7(NRST)
OSC_IN: C26.2 U9.5(OSC_IN) X1.2(IN/OUT)
OSC_OUT: C27.2 U9.6(OSC_OUT) X1.1(IN/OUT)
PWR_BR: Q1.2(G2) Q1.5(G1) R14.2 U9.19(PB1)
SWCLK: J1.3(A) U9.37(PA14)
SWDIO: J1.2(A) U9.34(PA13)
TPWR: C28.2 J4.1(VCC) Q1.3(D1) R11.1 R15.1
TRACE_SWO: J1.5(A) U9.39(PB3)
USB+: D1.4(I/O_3) R6.1 R8.1
USB-: D1.6(I/O_4) R5.1
USB_DATA+: D1.3(I/O_2) J2.4
USB_DATA-: D1.1(I/O_1) J2.5
VBUS: R9.1 R10.1 U9.26(PB13)
xRXD: U12.6(2B)
xTCK: U11.7(1B)
xTDI: U11.6(2B)
xTDO: U12.7(1B)
xTMS: U13.6(2B)
xTPWR: C10.2 C11.2 C12.2 C13.2 R15.2 U10.8(VCCB) U11.8(VCCB) U12.8(VCCB) U13.8(VCCB)
xTXD: U10.6(2B)
NetC2_2: C2.2 R11.2 R12.1 U9.18(PB0)
NetJ2_6: J2.6 ; port P_LED_D
NetJ2_7: J2.7 ; port P_LED_CLK
NetJ2_8: J2.8 ; port P_LED_LD
NetJ2_9: J2.9 ; port P_SW+
NetJ2_10: J2.10 ; port P_SW-
NetJ4_2: J4.2(TMS) R20.2
NetJ4_4: J4.4(TCK) R19.2
NetJ4_6: J4.6(TDO) R18.2
NetJ4_8: J4.8(TDI) R17.2
NetJ4_10: J4.10(tRST) R16.2
NetLED1_1: LED1.1(Anode) R1.2
NetLED2_1: LED2.1(Anode) R2.2
NetLED3_1: LED3.1(Anode) R3.2
NetLED4_1: LED4.1(Anode) R4.2
NetQ1_1: Q1.1(S2) Q1.4(S1) R14.1
NetR5_2: R5.2 U9.32(PA11)
NetR6_2: R6.2 U9.33(PA12)
NetR8_2: R8.2 U9.29(PA8)
NetR13_2: R13.2 S1.1 S1.2 U9.25(PB12)
NetR16_1: R16.1 ; port FC_NRST
NetR17_1: R17.1 ; port FC_TDI
NetR18_1: R18.1 ; port FC_TDO
NetR19_1: R19.1 ; port FC_TCK
NetR20_1: R20.1 ; port FC_TMS

Not connected (* = marked no-connect by the designer): J4 7(KEY)*; U9 2(PC13-TAMPER-RTC)* 3(PC14-OSC32_IN)* 4(PC15-OSC32_OUT)* 10(PA0-WKUP)* 27(PB14)* 28(PB15)* 38(PA15)* 43(PB7)* 45(PB8)* 46(PB9)*

### Notes on the sheet
- Black Magic Probe USB Debug Circuit
- Components that need footprints:
  - DMG1023
  - SAM8796
  - 74LVCT45
  - Standard 5 pin header
  - ECS-80-18-5G3X-JGN-TR
  - PTS 647
- Control Board Page 1
- 1
- v1.0
- Jaden Bottemiller

### Library data of the parts
C2 C3 C5 C7-C13 C22-C25 C28 = CMP-1590-00004-1: as C29 on sheet FC_MC_SCH; PackageReference: CAPC0402(1005)60
C4 = CMP-1590-00004-1: as C30 on sheet FC_MC_SCH; PackageReference: CAPC0402(1005)60
C6 = CMP-1590-00004-1: as C32 on sheet FC_MC_SCH; PackageReference: CAPC0402(1005)60
C26 C27 = CMP-1590-00004-1: 0402 (1005 Metric) Chip Capacitor; Case-EIA: 0402; Value: 18pF; Case-Metric: 1005; PackageReference: CAPC0402(1005)60
D1 = CMP-2000-05378-1: Very low capacitance ESD protection, 3.5 pF, -40 to 125 degC, 6-Pin SOT23, RoHS, Tape and Reel; Manufacturer: STMicroelectronics; Polarity: Uni-Directional; Clamping Voltage: 17V; Rad Hardened: No; Product Height (mm): 1.3mm; Leakage Current (Max): 0.15uA; Product Length (mm): 3.05mm; Number of Elements: 1; Peak Pulse Current: 5A; Configuration: Dual; Reverse Breakdown Voltage: 6V; Working Voltage (Max): 5V; Capacitance Value: 3.5pF; Suppressor Type: DiodeArrays; Product Depth (mm): 1.75mm; Test Current (It): 1mA; Package / Case: SOT-23; Operating Temperature Max Deg. C: 125C; Package Description: 6-Pin Small Outline Transistor, Body 2.925 x 1.625 mm, Pitch 0.95 mm; Package Reference: SOT23-6L; Datasheet Version: Rev. 5, 10/2011; Operating Temperature Min Deg. C: -40C; Mounting Style: SurfaceMount; Direction Type: Uni-Directional; Mounting: SurfaceMount; Pin Count: 6; Leakage Current: 0.15uA; Packaging: TapeandReel; Operating Temperature Classification: Automotive; Clamping Voltage (Max): 17V; Manufacturer URL: http://www.st.com/; Reverse Stand-off Voltage: 5V; Datasheet URL: http://www.st.com/st-web-ui/static/active/en/resource/technical/document/datasheet/CD00050750.pdf; Working Voltage: 5V; Operating Temp Range: -40Cto125C
J2 = SFV10R-2STE1HLF: System: Connector
LED2-LED4 = LED_GRN
R1-R4 = RES: Value: 330
R5 R6 = RES: Value: 22
R8 = RES: Value: 1.5k
R9 R11 = RES: Value: 4.7k
R10 R12 R13 = RES: Value: 10k
R14-R20 = RES: Value: 100
S1 = TactileSW
U9 = CMP-0237-00304-1: ARM Cortex-M3 32-bit MCU, 128 KB Flash, 20 KB Internal RAM, 37 I/Os, 48-Pin UFQFPN, -40 to 85 degC, Tape and Reel; I/Os (High Current): 36; Internal RAM Size (kB): 20; Operating Frequency(F) (Processor speed) (MHz): 72; Supply Voltage(Vcc) min (V): 2; FLASH Size (Prog) (kB): 128; Packing: Tape and Reel; ComponentLink2URL: http://www.st.com/st-web-ui/static/active/en/resource/technical/document/datasheet/CD00161566.pdf; ComponentLink1Description: Manufacturer URL; Package Reference: UFQFPN48; Mounting Technology: Surface Mount; Core: ARM Cortex-M3; ComponentLink2Description: Datasheet; Package Description: 48-Pin Ultra Thin Fine Pitch Quad Flat No-Lead, 7 x 7 x 0.6 mm Body, 0.5 mm Pitch, Exposed Pad; DatasheetVersion: Rev. 17; ComponentLink1URL: http://www.st.com/

## Sheet AUX_CPU_SCH.SchDoc
size A
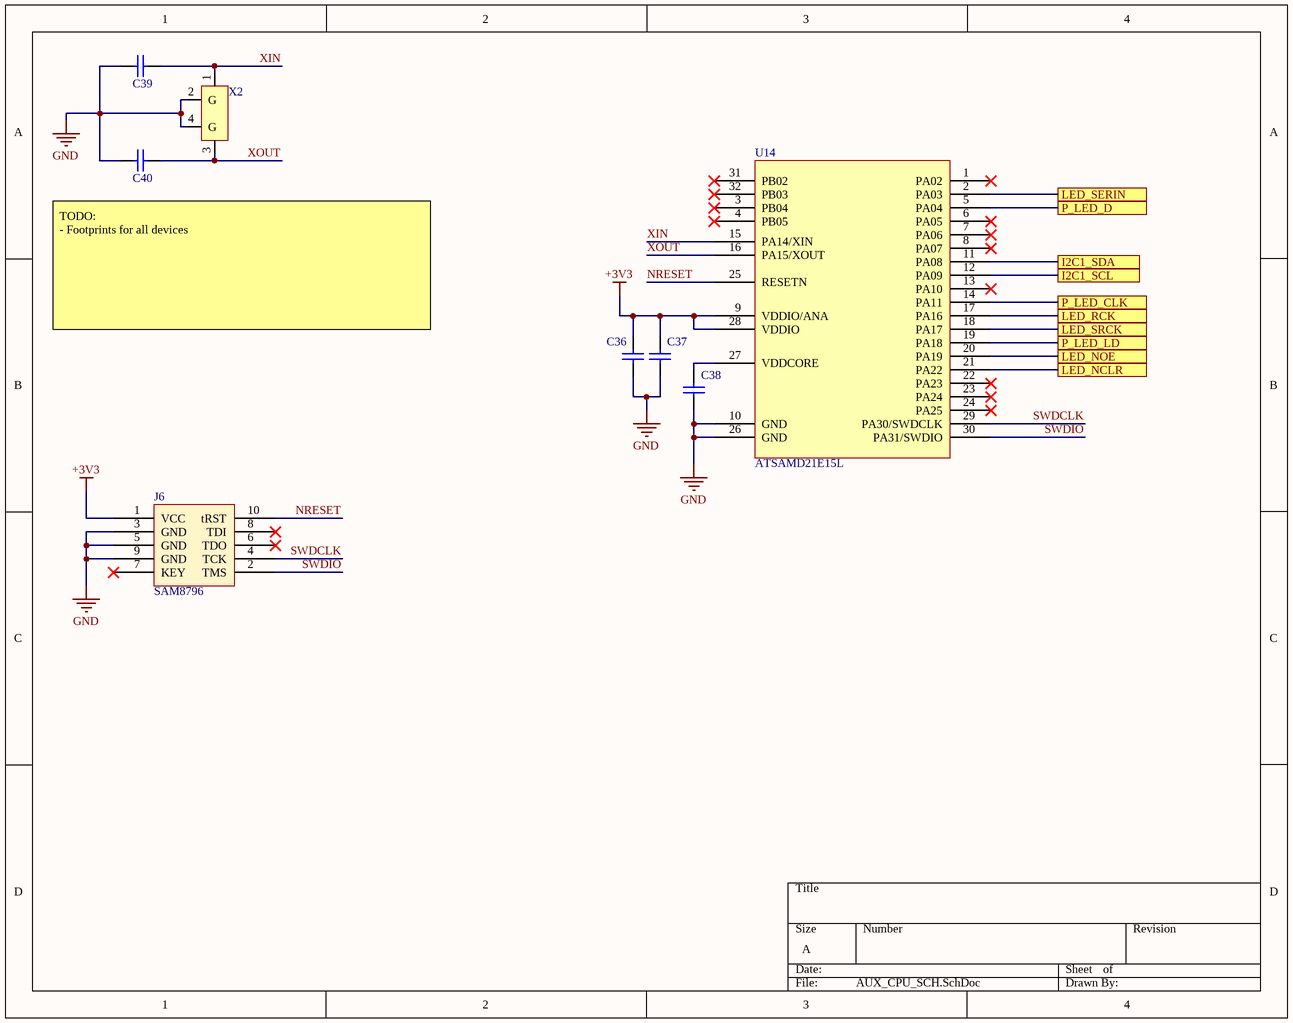
[diagram p6: AUX_CPU_SCH.SchDoc]

### Parts
C36  CAP0402  [CAPC0402(1005)60_L]  (value not drawn)
C37  CAP0402  [CAPC0402(1005)60_L]  (value not drawn)
C38  CAP0402  [CAPC0402(1005)60_L]  (value not drawn)
C39  CAP0402  [CAPC0402(1005)60_L]  (value not drawn)
C40  CAP0402  [CAPC0402(1005)60_L]  (value not drawn)
J6  SAM8796
U14  ATSAMD21E15L
X2  ECS-480-18-30B-AGN-TR  (value not drawn)

### Ports
I2C1_SCL, I2C1_SDA, LED_NCLR, LED_NOE, LED_RCK, LED_SERIN, LED_SRCK, P_LED_CLK, P_LED_D, P_LED_LD

### Nets
+3V3: C36.2 C37.2 J6.1(VCC) U14.9(VDDIO/ANA) U14.28(VDDIO)
GND: C36.1 C37.1 C38.1 C39.2 C40.2 J6.3(GND) J6.5(GND) J6.9(GND) U14.10(GND) U14.26(GND) X2.2(G) X2.4(G)
NRESET: J6.10(tRST) U14.25(RESETN)
SWDCLK: J6.4(TCK) U14.29(PA30/SWDCLK)
SWDIO: J6.2(TMS) U14.30(PA31/SWDIO)
XIN: C39.1 U14.15(PA14/XIN) X2.1(XIN)
XOUT: C40.1 U14.16(PA15/XOUT) X2.3(XOUT)
NetC38_2: C38.2 U14.27(VDDCORE)
NetJ2_6: U14.5(PA04) ; port P_LED_D
NetJ2_7: U14.14(PA11) ; port P_LED_CLK
NetJ2_8: U14.19(PA18) ; port P_LED_LD
NetU4_2: U14.2(PA03) ; port LED_SERIN
NetU4_9: U14.21(PA22) ; port LED_NCLR
NetU4_10: U14.20(PA19) ; port LED_NOE
NetU4_12: U14.17(PA16) ; port LED_RCK
NetU4_19: U14.18(PA17) ; port LED_SRCK
NetU14_11: U14.11(PA08) ; port I2C1_SDA
NetU14_12: U14.12(PA09) ; port I2C1_SCL

Not connected (* = marked no-connect by the designer): J6 6(TDO)* 7(KEY)* 8(TDI)*; U14 1(PA02)* 3(PB04)* 4(PB05)* 6(PA05)* 7(PA06)* 8(PA07)* 13(PA10)* 22(PA23)* 23(PA24)* 24(PA25)* 31(PB02)* 32(PB03)*

### Notes on the sheet
- TODO:
  - Footprints for all devices

### Library data of the parts
C36 C38 = CMP-1590-00004-1: as C30 on sheet FC_MC_SCH; PackageReference: CAPC0402(1005)60
C37 = CMP-1590-00004-1: as C29 on sheet FC_MC_SCH; PackageReference: CAPC0402(1005)60
C39 C40 = CMP-1590-00004-1: as C26 on sheet Black_Magic_SCH; PackageReference: CAPC0402(1005)60

## Sheet Bluetooth_SCH.SchDoc
size A

## Nets that join several sheets
3V3: IMU_SCH (7 pins), LED_SCH (C1.2 U4.1)
5V: Signal_Pow_Reg_SCH (C41.2 J5.3 U15.1 U15.3), Black_Magic_SCH (J2.2)
+3V3: FC_MC_SCH (13 pins), WiFi_SCH (7 pins), Black_Magic_SCH (27 pins), AUX_CPU_SCH (5 pins)
GND: FC_MC_SCH (17 pins), WiFi_SCH (R22.1 U16.33), IMU_SCH (26 pins), LED_SCH (C1.1 U4.20), Signal_Pow_Reg_SCH (13 pins), Black_Magic_SCH (49 pins), AUX_CPU_SCH (12 pins)
USB_5V: Signal_Pow_Reg_SCH (R23.2 U18.7), Black_Magic_SCH (D1.5 J2.3 R9.2)
VCC: LED_SCH (12 pins), Signal_Pow_Reg_SCH (J5.2)
NetJ2_6: Black_Magic_SCH (J2.6), AUX_CPU_SCH (U14.5)
NetJ2_7: Black_Magic_SCH (J2.7), AUX_CPU_SCH (U14.14)
NetJ2_8: Black_Magic_SCH (J2.8), AUX_CPU_SCH (U14.19)
NetU4_2: LED_SCH (U4.2), AUX_CPU_SCH (U14.2)
NetU4_9: LED_SCH (U4.9), AUX_CPU_SCH (U14.21)
NetU4_10: LED_SCH (U4.10), AUX_CPU_SCH (U14.20)
NetU4_12: LED_SCH (U4.12), AUX_CPU_SCH (U14.17)
NetU4_19: LED_SCH (U4.19), AUX_CPU_SCH (U14.18)